# EasyEDA Pro project Sensor_colis_examples.epro, board 2024-06-03_06-37-18
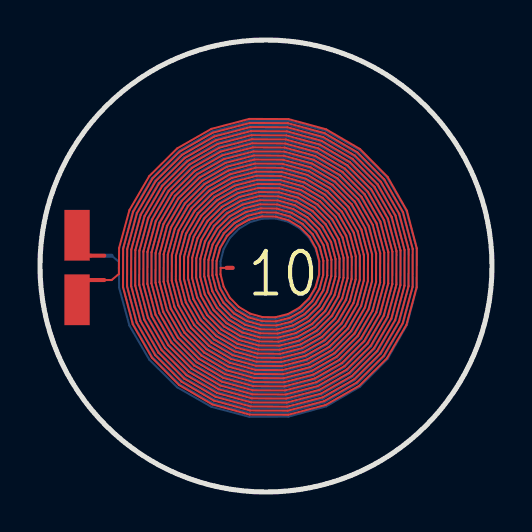
[diagram p18: board, top side]
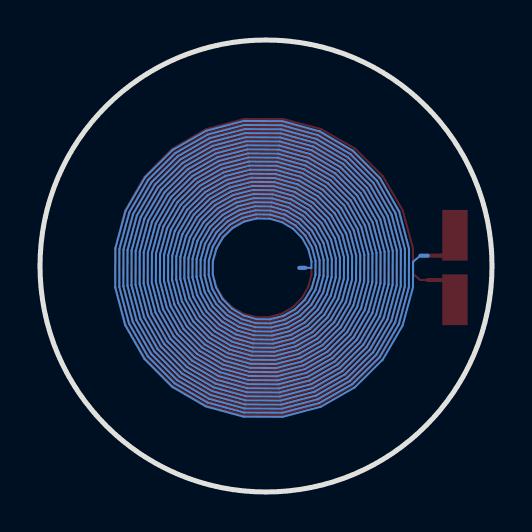
[diagram p19: board, bottom side, seen from below]

Outline 22.61 x 22.61 mm; copper layers: Top Layer, MidLayer1, MidLayer2, Bottom Layer. Coordinates in mm from the lower left corner of the outline.
Outline path: circle c11.3,11.3 r11.3
Stack: Top Layer 0.0356mm / SUBSTRATE1 0.32mm FR-4 er 4.8 / SUBSTRATE4 0.32mm FR-4 er 4.8 / SUBSTRATE5 0.32mm FR-4 er 4.8 / MidLayer1 0.0356mm / SUBSTRATE2 0.32mm FR-4 er 4.8 / MidLayer2 0.0356mm / SUBSTRATE3 0.32mm FR-4 er 4.8 / Bottom Layer 0.0356mm

## Design rules (mm)
spacing safeClearance (default): track to track 0.152, other pairs 0.152 to 0.3
track width trackWidth (default): min 0.127, default 0.254, max 2.54
differential pair differentialPair (default): width min 0.127, default 0.254, max 2.54; gap min 0.152, default 0.152
via viaSize (default): diameter min 0.5, default 0.61, max 10; hole min 0.3, default 0.305, max 6

## Placement (name value [footprint] x y rotation side)
CSENSOR  -  [0402]  1.85 11.3 90 top

## Footprints (pads in the part's own frame, mm; a bottom-side part is the same pattern mirrored in y, then rotated)
0402
  rect 2.54x1.27 smd: 1(-1.689,0) 2(1.536,0)

## Nets
3: CSENSOR.1 CSENSOR.2

## Routing (per net, layer and track width the routed paths; a pad name or vN(x,y) marks a point on that pad's centre or on a via; arc(x,y) is an arc through that point)
3: length 1572.1
  Top Layer w0.102: 3.22,10.6 3.58,10.6 3.95,10.9 3.95,11.21 3.96,12.2 4.47,14.1 5.47,15.8 6.86,17.18 8.57,18.16 10.47,18.66 12.43,18.65 14.31,18.13 16,17.15 17.38,15.76 18.35,14.07 18.84,12.18 18.84,10.24 18.32,8.36 17.35,6.68 15.97,5.32 14.29,4.36 12.41,3.86 10.48,3.87 8.62,4.38 6.95,5.35 5.59,6.72 4.64,8.39 4.15,10.25 4.16,12.17 4.66,14.02 5.63,15.67 6.99,17.02 8.65,17.97 10.49,18.46 12.4,18.45 14.24,17.95 15.88,16.99 17.22,15.64 18.16,13.99 18.64,12.16 18.63,10.26 18.14,8.44 17.18,6.81 15.84,5.48 14.21,4.54 12.39,4.07 10.51,4.07 8.7,4.57 7.08,5.51 5.76,6.84 4.83,8.47 4.35,10.28 4.36,12.14 4.85,13.94 5.79,15.55 7.11,16.86 8.72,17.78 10.52,18.25 12.37,18.24 14.16,17.76 15.75,16.82 17.06,15.51 17.97,13.91 18.44,12.13 18.43,10.29 17.95,8.52 17.02,6.93 15.72,5.64 14.13,4.73 12.36,4.27 10.53,4.28 8.77,4.76 7.2,5.68 5.92,6.97 5.02,8.55 4.56,10.3 4.56,12.12 5.04,13.86 5.95,15.42 7.24,16.7 8.8,17.59 10.55,18.05 12.35,18.04 14.08,17.57 15.63,16.66 16.89,15.39 17.78,13.83 18.24,12.1 18.23,10.32 17.76,8.6 16.86,7.06 15.59,5.8 14.05,4.92 12.33,4.47 10.56,4.48 8.85,4.95 7.33,5.84 6.08,7.09 5.21,8.63 4.76,10.33 4.77,12.09 5.23,13.78 6.12,15.3 7.36,16.53 8.88,17.4 10.57,17.85 12.32,17.84 14,17.38 15.51,16.5 16.73,15.26 17.59,13.75 18.03,12.08 18.02,10.34 17.57,8.67 16.7,7.18 15.47,5.97 13.97,5.11 12.31,4.68 10.59,4.68 8.93,5.14 7.45,6 6.25,7.22 5.4,8.7 4.96,10.36 4.97,12.06 5.42,13.71 6.28,15.18 7.49,16.37 8.96,17.21 10.6,17.64 12.29,17.63 13.92,17.19 15.38,16.34 16.57,15.14 17.4,13.68 17.83,12.05 17.82,10.37 17.38,8.75 16.53,7.31 15.34,6.13 13.89,5.3 12.28,4.88 10.61,4.89 9.01,5.33 7.57,6.16 6.41,7.34 5.59,8.78 5.17,10.38 5.17,12.04 5.61,13.63 6.44,15.05 7.61,16.21 9.04,17.02 10.63,17.44 12.27,17.43 13.84,17 15.26,16.17 16.4,15.01 17.21,13.6 17.63,12.02 17.62,10.4 17.19,8.83 16.37,7.43 15.22,6.29 13.81,5.49 12.25,5.08 10.64,5.09 9.09,5.52 7.7,6.33 6.57,7.47 5.78,8.86 5.37,10.41 5.38,12.01 5.8,13.55 6.6,14.93 7.74,16.05 9.12,16.83 10.65,17.24 12.24,17.23 13.77,16.81 15.13,16.01 16.24,14.89 17.02,13.52 17.42,12 17.41,10.42 17,8.91 16.21,7.56 15.09,6.46 13.74,5.68 12.23,5.28 10.67,5.29 9.17,5.7 7.82,6.49 6.73,7.59 5.97,8.94 5.57,10.44 5.58,11.98 5.99,13.47 6.77,14.8 7.86,15.88 9.2,16.64 10.68,17.03 12.21,17.02 13.69,16.62 15.01,15.85 16.08,14.76 16.83,13.44 17.22,11.97 17.21,10.45 16.81,8.99 16.05,7.68 14.97,6.62 13.66,5.87 12.2,5.49 10.69,5.5 9.24,5.89 7.95,6.65 6.9,7.72 6.15,9.02 5.78,10.46 5.78,11.96 6.18,13.39 6.93,14.68 7.99,15.72 9.27,16.45 10.71,16.83 12.19,16.82 13.61,16.43 14.88,15.69 15.92,14.64 16.64,13.36 17.02,11.94 17.01,10.48 16.62,9.07 15.88,7.81 14.85,6.78 13.58,6.06 12.17,5.69 10.72,5.7 9.32,6.08 8.07,6.81 7.06,7.84 6.34,9.1 5.98,10.49 5.99,11.93 6.37,13.31 7.09,14.55 8.11,15.56 9.35,16.27 10.73,16.63 12.16,16.62 13.53,16.24 14.76,15.52 15.75,14.51 16.46,13.28 16.81,11.92 16.8,10.5 16.43,9.14 15.72,7.93 14.72,6.94 13.5,6.25 12.15,5.89 10.75,5.9 9.4,6.27 8.2,6.98 7.22,7.97 6.53,9.17 6.18,10.52 6.19,11.9 6.56,13.24 7.25,14.43 8.24,15.4 9.43,16.08 10.76,16.42 12.13,16.41 13.45,16.05 14.63,15.36 15.59,14.39 16.27,13.21 16.61,11.89 16.6,10.53 16.24,9.22 15.56,8.06 14.6,7.11 13.42,6.44 12.12,6.1 10.77,6.11 9.48,6.46 8.32,7.14 7.38,8.09 6.72,9.25 6.39,10.54 6.39,11.87 6.75,13.16 7.42,14.3 8.36,15.23 9.51,15.89 10.79,16.22 12.1,16.21 13.37,15.86 14.51,15.2 15.43,14.27 16.08,13.13 16.41,11.86 16.4,10.56 16.05,9.3 15.4,8.18 14.47,7.27 13.34,6.63 12.09,6.3 10.8,6.31 9.56,6.65 8.45,7.3 7.55,8.22 6.91,9.33 6.59,10.57 6.6,11.85 6.94,13.08 7.58,14.18 8.48,15.07 9.59,15.7 10.81,16.02 12.08,16.01 13.3,15.67 14.38,15.04 15.27,14.14 15.89,13.05 16.2,11.84 16.19,10.58 15.86,9.38 15.23,8.3 14.35,7.43 13.27,6.82 12.07,6.5 10.83,6.51 9.64,6.84 8.57,7.46 7.71,8.34 7.1,9.41 6.79,10.6 6.8,11.82 7.12,13 7.74,14.05 8.61,14.91 9.67,15.51 10.84,15.81 12.05,15.81 13.22,15.48 14.26,14.87 15.1,14.02 15.7,12.97 16,11.81 15.99,10.61 15.67,9.46 15.07,8.43 14.22,7.59 13.19,7.01 12.04,6.71 10.85,6.72 9.72,7.03 8.7,7.63 7.87,8.47 7.29,9.49 7,10.62 7,11.79 7.31,12.92 7.91,13.93 8.73,14.74 9.74,15.32 10.87,15.61 12.03,15.6 13.14,15.29 14.13,14.71 14.94,13.89 15.51,12.89 15.8,11.78 15.79,10.64 15.48,9.54 14.91,8.55 14.1,7.76 13.11,7.2 12.01,6.91 10.88,6.92 9.79,7.22 8.82,7.79 8.03,8.59 7.48,9.57 7.2,10.65 7.21,11.77 7.5,12.84 8.07,13.8 8.86,14.58 9.82,15.13 10.89,15.41 12,15.4 13.06,15.11 14.01,14.55 14.78,13.77 15.32,12.81 15.59,11.76 15.59,10.66 15.29,9.62 14.74,8.68 13.97,7.92 13.03,7.38 11.99,7.11 10.91,7.12 9.87,7.41 8.95,7.95 8.2,8.72 7.67,9.64 7.4,10.68 7.41,11.74 7.69,12.76 8.23,13.68 8.98,14.42 9.9,14.94 10.92,15.2 11.97,15.2 12.98,14.92 13.88,14.39 14.62,13.64 15.13,12.74 15.39,11.73 15.38,10.69 15.11,9.69 14.58,8.8 13.85,8.08 12.95,7.57 11.96,7.32 10.94,7.33 9.95,7.6 9.07,8.11 8.36,8.84 7.86,9.72 7.6,10.7 7.61,11.71 7.88,12.69 8.39,13.55 9.11,14.26 9.98,14.75 10.95,15 11.94,14.99 12.9,14.73 13.76,14.22 14.45,13.52 14.94,12.66 15.19,11.7 15.18,10.72 14.92,9.77 14.42,8.93 13.72,8.24 12.87,7.76 11.93,7.52 10.96,7.53 10.03,7.79 9.2,8.28 8.52,8.96 8.05,9.8 7.81,10.73 7.82,11.69 8.07,12.61 8.56,13.43 9.23,14.09 10.06,14.56 10.97,14.8 11.92,14.79 12.82,14.54 13.63,14.06 14.29,13.39 14.75,12.58 14.98,11.68 14.98,10.75 14.73,9.85 14.26,9.05 13.6,8.41 12.8,7.95 11.91,7.72 10.99,7.73 10.11,7.98 9.32,8.44 8.68,9.09 8.24,9.88 8.01,10.76 8.02,11.66 8.26,12.53 8.72,13.3 9.36,13.93 10.14,14.37 11,14.59 11.89,14.59 12.75,14.35 13.51,13.9 14.13,13.27 14.56,12.5 14.78,11.65 14.77,10.77 14.54,9.93 14.09,9.18 13.47,8.57 12.72,8.14 11.88,7.93 11.02,7.93 10.19,8.17 9.45,8.6 8.85,9.21 8.43,9.96 8.21,10.78 8.22,11.63 8.45,12.45 8.88,13.18 9.48,13.77 10.22,14.18 11.03,14.39 11.86,14.38 12.67,14.16 13.38,13.74 13.97,13.14 14.37,12.42 14.58,11.62 14.57,10.8 14.35,10.01 13.93,9.3 13.35,8.73 12.64,8.33 11.85,8.13 11.04,8.14 10.26,8.36 9.57,8.77 9.01,9.34 8.62,10.04 8.42,10.81 8.43,11.61 8.64,12.37 9.04,13.05 9.61,13.61 10.29,13.99 11.05,14.19 11.84,14.18 12.59,13.97 13.26,13.57 13.8,13.02 14.18,12.34 14.37,11.6 14.37,10.83 14.16,10.09 13.77,9.43 13.22,8.89 12.56,8.52 11.83,8.33 11.07,8.34 10.34,8.54 9.7,8.93 9.17,9.46 8.81,10.12 8.62,10.84 8.63,11.58 8.83,12.29 9.21,12.93 9.73,13.44 10.37,13.8 11.08,13.98 11.81,13.98 12.51,13.78 13.13,13.41 13.64,12.89 13.99,12.26 14.17,11.57 14.16,10.85 13.97,10.16 13.61,9.55 13.1,9.06 12.48,8.71 11.8,8.54 11.1,8.54 10.42,8.73 9.82,9.09 9.33,9.59 8.99,10.19 8.82,10.86 8.83,11.55 9.02,12.22 9.37,12.8 9.86,13.28 10.45,13.61 11.11,13.78 11.78,13.77 12.43,13.59 13.01,13.25 13.48,12.77 13.8,12.19 13.97,11.54 13.96,10.88 13.78,10.24 13.44,9.68 12.97,9.22 12.4,8.9 11.77,8.74 11.12,8.75 10.5,8.92 9.95,9.25 9.5,9.71 9.18,10.27 9.03,10.89 9.04,11.21 9.34,11.21
  Top Layer w0.203: 1.85,12 1.85,11.91 2.53,11.82 3.22,11.82 ; 3.22,10.6 1.85,10.6 ; 9.34,11.21 9.64,11.21
  Bottom Layer w0.102: 9.34,11.21 9.04,11.21 9.03,11.53 9.18,12.15 9.5,12.71 9.95,13.17 10.5,13.5 11.12,13.67 11.77,13.68 12.4,13.52 12.97,13.2 13.44,12.74 13.78,12.18 13.96,11.54 13.97,10.88 13.8,10.23 13.48,9.65 13.01,9.17 12.43,8.83 11.78,8.65 11.11,8.64 10.45,8.81 9.86,9.14 9.37,9.61 9.02,10.2 8.83,10.87 8.82,11.55 8.99,12.23 9.33,12.83 9.82,13.33 10.42,13.69 11.1,13.87 11.8,13.88 12.48,13.71 13.1,13.36 13.61,12.87 13.97,12.25 14.16,11.57 14.17,10.85 13.99,10.15 13.64,9.53 13.13,9.01 12.51,8.64 11.81,8.44 11.08,8.43 10.37,8.62 9.73,8.98 9.21,9.49 8.83,10.13 8.63,10.84 8.62,11.58 8.81,12.3 9.17,12.96 9.7,13.49 10.34,13.87 11.07,14.08 11.83,14.09 12.56,13.9 13.22,13.53 13.77,12.99 14.16,12.33 14.37,11.59 14.37,10.82 14.18,10.08 13.8,9.4 13.26,8.85 12.59,8.45 11.84,8.24 11.05,8.23 10.29,8.43 9.61,8.81 9.04,9.37 8.64,10.05 8.43,10.81 8.42,11.61 8.62,12.38 9.01,13.08 9.57,13.65 10.26,14.06 11.04,14.28 11.85,14.29 12.64,14.09 13.35,13.69 13.93,13.12 14.35,12.41 14.57,11.62 14.58,10.8 14.37,10 13.97,9.28 13.38,8.68 12.67,8.26 11.86,8.04 11.03,8.03 10.22,8.24 9.48,8.65 8.88,9.24 8.45,9.97 8.22,10.79 8.21,11.64 8.43,12.46 8.85,13.2 9.45,13.82 10.19,14.25 11.02,14.48 11.88,14.49 12.72,14.28 13.47,13.85 14.09,13.24 14.54,12.49 14.77,11.65 14.78,10.77 14.56,9.92 14.13,9.15 13.51,8.52 12.75,8.07 11.89,7.83 11,7.82 10.14,8.05 9.36,8.49 8.72,9.12 8.26,9.89 8.02,10.76 8.01,11.66 8.24,12.54 8.68,13.33 9.32,13.98 10.11,14.44 10.99,14.69 11.91,14.7 12.8,14.47 13.6,14.01 14.26,13.37 14.73,12.57 14.98,11.67 14.98,10.74 14.75,9.84 14.29,9.03 13.63,8.36 12.82,7.88 11.92,7.63 10.97,7.62 10.06,7.86 9.23,8.32 8.56,8.99 8.07,9.81 7.82,10.73 7.81,11.69 8.05,12.62 8.52,13.45 9.2,14.14 10.03,14.63 10.96,14.89 11.93,14.9 12.87,14.66 13.72,14.18 14.42,13.49 14.92,12.65 15.18,11.7 15.19,10.72 14.94,9.76 14.45,8.9 13.76,8.2 12.9,7.69 11.94,7.43 10.95,7.42 9.98,7.67 9.11,8.16 8.39,8.87 7.88,9.73 7.61,10.7 7.6,11.72 7.86,12.7 8.36,13.58 9.07,14.3 9.95,14.82 10.94,15.09 11.96,15.1 12.95,14.84 13.85,14.34 14.58,13.62 15.11,12.73 15.38,11.73 15.39,10.69 15.13,9.68 14.62,8.78 13.88,8.03 12.98,7.5 11.97,7.22 10.92,7.22 9.9,7.48 8.98,8 8.23,8.74 7.69,9.65 7.41,10.68 7.4,11.74 7.67,12.77 8.2,13.7 8.95,14.47 9.87,15.01 10.91,15.3 11.99,15.31 13.03,15.03 13.97,14.5 14.74,13.74 15.29,12.8 15.59,11.75 15.59,10.66 15.32,9.61 14.78,8.65 14.01,7.87 13.06,7.31 12,7.02 10.89,7.01 9.82,7.29 8.86,7.84 8.07,8.62 7.5,9.58 7.21,10.65 7.2,11.77 7.48,12.85 8.03,13.83 8.82,14.63 9.79,15.2 10.88,15.5 12.01,15.51 13.11,15.22 14.1,14.66 14.91,13.86 15.48,12.88 15.79,11.78 15.8,10.64 15.51,9.53 14.94,8.53 14.13,7.71 13.14,7.12 12.03,6.82 10.87,6.81 9.74,7.1 8.73,7.67 7.91,8.49 7.31,9.5 7,10.62 7,11.8 7.29,12.93 7.87,13.95 8.7,14.79 9.72,15.39 10.85,15.7 12.04,15.71 13.19,15.41 14.22,14.83 15.07,13.99 15.67,12.96 15.99,11.81 16,10.61 15.7,9.45 15.1,8.4 14.26,7.55 13.22,6.94 12.05,6.61 10.84,6.61 9.67,6.91 8.61,7.51 7.74,8.37 7.12,9.42 6.8,10.6 6.79,11.82 7.1,13.01 7.71,14.08 8.57,14.95 9.64,15.58 10.83,15.91 12.07,15.92 13.27,15.6 14.35,14.99 15.23,14.11 15.86,13.04 16.19,11.83 16.2,10.58 15.89,9.37 15.27,8.28 14.38,7.38 13.3,6.75 12.08,6.41 10.81,6.4 9.59,6.72 8.48,7.35 7.58,8.24 6.94,9.34 6.6,10.57 6.59,11.85 6.91,13.09 7.55,14.2 8.45,15.12 9.56,15.77 10.8,16.11 12.09,16.12 13.34,15.79 14.47,15.15 15.4,14.24 16.05,13.12 16.4,11.86 16.41,10.56 16.08,9.29 15.43,8.15 14.51,7.22 13.37,6.56 12.1,6.21 10.79,6.2 9.51,6.53 8.36,7.19 7.42,8.12 6.75,9.26 6.39,10.54 6.39,11.88 6.72,13.17 7.38,14.33 8.32,15.28 9.48,15.96 10.77,16.31 12.12,16.32 13.42,15.98 14.6,15.31 15.56,14.36 16.24,13.2 16.6,11.89 16.61,10.53 16.27,9.21 15.59,8.03 14.63,7.06 13.45,6.37 12.13,6 10.76,6 9.43,6.34 8.24,7.02 7.25,7.99 6.56,9.18 6.19,10.52 6.18,11.9 6.53,13.24 7.22,14.45 8.2,15.44 9.4,16.15 10.75,16.52 12.15,16.52 13.5,16.17 14.72,15.48 15.72,14.49 16.43,13.27 16.8,11.91 16.81,10.5 16.46,9.14 15.75,7.9 14.76,6.9 13.53,6.18 12.16,5.8 10.73,5.79 9.35,6.15 8.11,6.86 7.09,7.87 6.37,9.11 5.99,10.49 5.98,11.93 6.34,13.32 7.06,14.58 8.07,15.61 9.32,16.34 10.72,16.72 12.17,16.73 13.58,16.36 14.85,15.64 15.88,14.61 16.62,13.35 17.01,11.94 17.02,10.48 16.64,9.06 15.92,7.78 14.88,6.73 13.61,5.99 12.19,5.6 10.71,5.59 9.27,5.96 7.99,6.7 6.93,7.74 6.18,9.03 5.78,10.46 5.78,11.96 6.15,13.4 6.9,14.7 7.95,15.77 9.24,16.53 10.69,16.92 12.2,16.93 13.66,16.55 14.97,15.8 16.05,14.74 16.81,13.43 17.21,11.97 17.22,10.45 16.83,8.98 16.08,7.65 15.01,6.57 13.69,5.8 12.21,5.39 10.68,5.39 9.2,5.78 7.86,6.54 6.77,7.62 5.99,8.95 5.58,10.44 5.57,11.98 5.97,13.48 6.73,14.83 7.82,15.93 9.17,16.71 10.67,17.13 12.23,17.13 13.74,16.74 15.09,15.96 16.21,14.86 17,13.51 17.41,12 17.42,10.42 17.02,8.9 16.24,7.53 15.13,6.41 13.77,5.61 12.24,5.19 10.65,5.18 9.12,5.59 7.74,6.37 6.6,7.49 5.8,8.87 5.38,10.41 5.37,12.01 5.78,13.56 6.57,14.95 7.7,16.09 9.09,16.9 10.64,17.33 12.25,17.34 13.81,16.93 15.22,16.13 16.37,14.99 17.19,13.59 17.62,12.02 17.63,10.4 17.21,8.82 16.4,7.41 15.26,6.25 13.84,5.42 12.27,4.99 10.63,4.98 9.04,5.4 7.61,6.21 6.44,7.37 5.61,8.79 5.17,10.38 5.17,12.04 5.59,13.64 6.41,15.08 7.57,16.26 9.01,17.09 10.61,17.53 12.28,17.54 13.89,17.12 15.34,16.29 16.53,15.11 17.38,13.67 17.82,12.05 17.83,10.37 17.4,8.74 16.57,7.28 15.38,6.08 13.92,5.23 12.29,4.79 10.6,4.78 8.96,5.21 7.49,6.05 6.28,7.24 5.42,8.71 4.97,10.36 4.96,12.06 5.4,13.72 6.25,15.2 7.45,16.42 8.93,17.28 10.59,17.74 12.31,17.74 13.97,17.31 15.47,16.45 16.7,15.24 17.57,13.74 18.02,12.08 18.03,10.34 17.59,8.66 16.73,7.16 15.51,5.92 14,5.04 12.32,4.58 10.57,4.57 8.88,5.02 7.36,5.89 6.12,7.12 5.23,8.64 4.77,10.33 4.76,12.09 5.21,13.79 6.08,15.33 7.33,16.58 8.85,17.47 10.56,17.94 12.33,17.95 14.05,17.5 15.59,16.61 16.86,15.36 17.76,13.82 18.23,12.1 18.24,10.32 17.78,8.59 16.89,7.03 15.63,5.76 14.08,4.85 12.35,4.38 10.55,4.37 8.8,4.83 7.24,5.72 5.95,6.99 5.04,8.56 4.56,10.3 4.56,12.12 5.02,13.87 5.92,15.45 7.2,16.74 8.77,17.66 10.53,18.14 12.36,18.15 14.13,17.69 15.72,16.78 17.02,15.49 17.95,13.9 18.43,12.13 18.44,10.29 17.97,8.51 17.06,6.91 15.75,5.59 14.16,4.66 12.37,4.18 10.52,4.17 8.72,4.64 7.11,5.56 5.79,6.87 4.85,8.48 4.36,10.28 4.35,12.14 4.83,13.95 5.76,15.58 7.08,16.91 8.7,17.85 10.51,18.35 12.39,18.35 14.21,17.87 15.84,16.94 17.18,15.61 18.14,13.98 18.63,12.16 18.64,10.26 18.16,8.43 17.22,6.78 15.88,5.43 14.24,4.47 12.4,3.97 10.49,3.96 8.65,4.45 6.99,5.4 5.63,6.75 4.66,8.4 4.16,10.25 4.15,12.17 4.64,14.03 5.59,15.7 6.95,17.07 8.62,18.04 10.48,18.55 12.41,18.56 14.29,18.06 15.97,17.1 17.35,15.74 18.32,14.06 18.84,12.18 18.84,10.24 18.35,8.35 17.38,6.66 16,5.27 14.31,4.28 12.43,3.77 10.47,3.76 8.57,4.26 6.86,5.24 5.47,6.62 4.47,8.32 3.96,10.22 3.95,11.21 3.95,11.51 3.58,11.82
  Bottom Layer w0.203: 9.34,11.21 9.64,11.21 ; 3.58,11.82 3.22,11.82

## Text on the board
Top Silkscreen Layer: Layers = 2 | Turns = 25 | Version - 1.1 | -------------- | Design Id - 112 | Coil Parameters | Customized for LDC1612 | Trace Width = 4.0 mils | Layer Stack Information | Trace Spacing = 4.0 mils | ------------------------- | WEBENCH Design Information | Copper thickness = 1.0 Oz-Cu | Exported on - 2024/06/03 06:37:16 | Inner Diameter = 191 mils (Approx.) | Outer Diameter = 591 mils (Approx.) | Space between TOP and BOTTOM = 4.0 mils | Exported from WEBENCH Coil Designer Tool | 10
